# Altium schematic sheet COUNTER.SchDoc
size A4
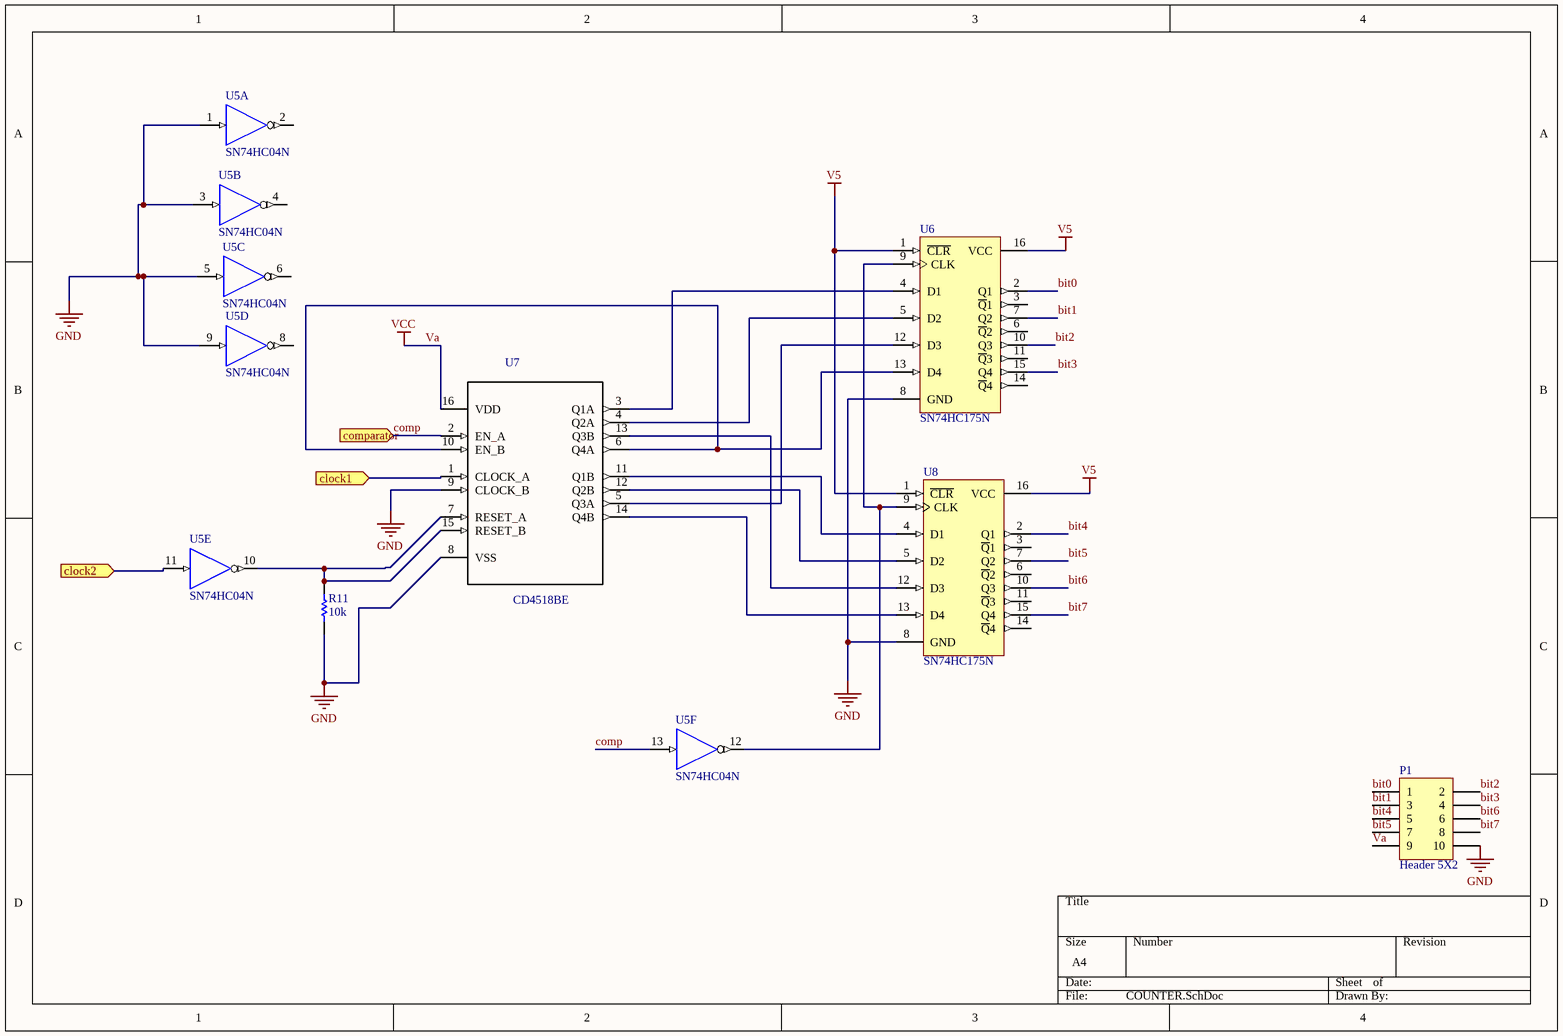
[diagram p0: COUNTER.SchDoc]

## Parts
P1  Header 5X2  [HDR2X5]
R11  10k  [RES400]
U5  SN74HC04N  [N014]  (parts A,B,C,D,E,F of 6)
U6  SN74HC175N  [N016]
U7  CD4518BE  [*DIP254P762X508-16]
U8  SN74HC175N  [N016]

## Ports
clock1 (in), clock2 (in), comparator (in)

## Nets
GND: P1.10 R11.1 U5.1(A) U5.3(A) U5.5(A) U5.7(GND) U5.9(A) U6.8(GND) U7.8(VSS) U7.9(CLOCK_B) U8.8(GND)
V5: U5.14(V5) U6.1(~{CLR}) U6.16(VCC) U8.1(~{CLR}) U8.16(VCC)
Va: P1.9 U7.16(VDD)  [also labelled VCC]
bit0: P1.1 U6.2(Q1)
bit1: P1.3 U6.7(Q2)
bit2: P1.2 U6.10(Q3)
bit3: P1.4 U6.15(Q4)
bit4: P1.5 U8.2(Q1)
bit5: P1.7 U8.7(Q2)
bit6: P1.6 U8.10(Q3)
bit7: P1.8 U8.15(Q4)
clock1: U7.1(CLOCK_A) ; port clock1
clock2: U5.11(A) ; port clock2
comp: U5.13(A) U7.2(EN_A) ; port comparator
NetR11_2: R11.2 U5.10(Y) U7.7(RESET_A) U7.15(RESET_B)
NetU5_12: U5.12(Y) U6.9(CLK) U8.9(CLK)
NetU6_4: U6.4(D1) U7.3(Q1A)
NetU6_5: U6.5(D2) U7.4(Q2A)
NetU6_12: U6.12(D3) U7.5(Q3A)
NetU6_13: U6.13(D4) U7.6(Q4A) U7.10(EN_B)
NetU7_11: U7.11(Q1B) U8.4(D1)
NetU7_12: U7.12(Q2B) U8.5(D2)
NetU7_13: U7.13(Q3B) U8.12(D3)
NetU7_14: U7.14(Q4B) U8.13(D4)

Not connected (* = marked no-connect by the designer): U5 2(Y) 4(Y) 6(Y) 8(Y); U6 3(~{Q}1) 6(~{Q}2) 11(~{Q}3) 14(~{Q}4); U8 3(~{Q}1) 6(~{Q}2) 11(~{Q}3) 14(~{Q}4)

## Library data of the parts
P1 = Header 5X2: Header, 5-Pin, Dual row; LatestRevisionDate: 17-Jul-2002; LatestRevisionNote: Re-released for DXP Platform.; Publisher: Altium Limited
R11 = RES
U5 = SN74HC04N: Hex Inverter; Published: 8-Jun-2000; LatestRevisionDate: 04-Mar-2005; LatestRevisionNote: Stylized 3D Model Added.; DatasheetVersion: May-1997; PackageVersion: Oct-1995; PackageReference: N014; Publisher: Altium Limited; PackageDescription: DIP; 14 Leads; Row Spacing 7.62 mm; Pitch 2.54 mm; ComponentLink1Description: Manufacturer Link; ComponentLink1URL: http://www.ti.com/; ComponentLink2Description: Datasheet; ComponentLink2URL: http://www-s.ti.com/sc/ds/sn74hc04.pdf
U6 U8 = SN74HC175N: Quadruple D-Type Flip-Flop with Clear; Published: 8-Jun-2000; LatestRevisionDate: 04-Mar-2005; LatestRevisionNote: Stylized 3D Model Added.; DatasheetVersion: May-1997; PackageVersion: Oct-1995; PackageReference: N016; Publisher: Altium Limited; PackageDescription: DIP; 16 Leads; Row Spacing 7.62 mm; Pitch 2.54 mm; Code_JEDEC: MS-001-BB; ComponentLink1Description: Manufacturer Link; ComponentLink1URL: http://www.ti.com/; ComponentLink2Description: Datasheet; ComponentLink2URL: http://www-s.ti.com/sc/ds/sn74hc175.pdf
U7 = CD4518BE: MF: Texas Instruments; MP: CD4518BE; Package: DIP-16 RCA; Digi-Key_Purchase_URL: https://www.digikey.com.ar/product-detail/en/texas-instruments/CD4518BE/296-2076-5-ND/67351?utm_source=snapeda&utm_medium=aggregator&utm_campaign=symbol; Digi-Key_Part_Number: 296-2076-5-ND; SnapEDA_Link: https://www.snapeda.com/parts/CD4518BE/Texas%20Instruments/view-part/?ref=snap; Value: *